# Altium schematic sheet Sheet1.SchDoc
size A4
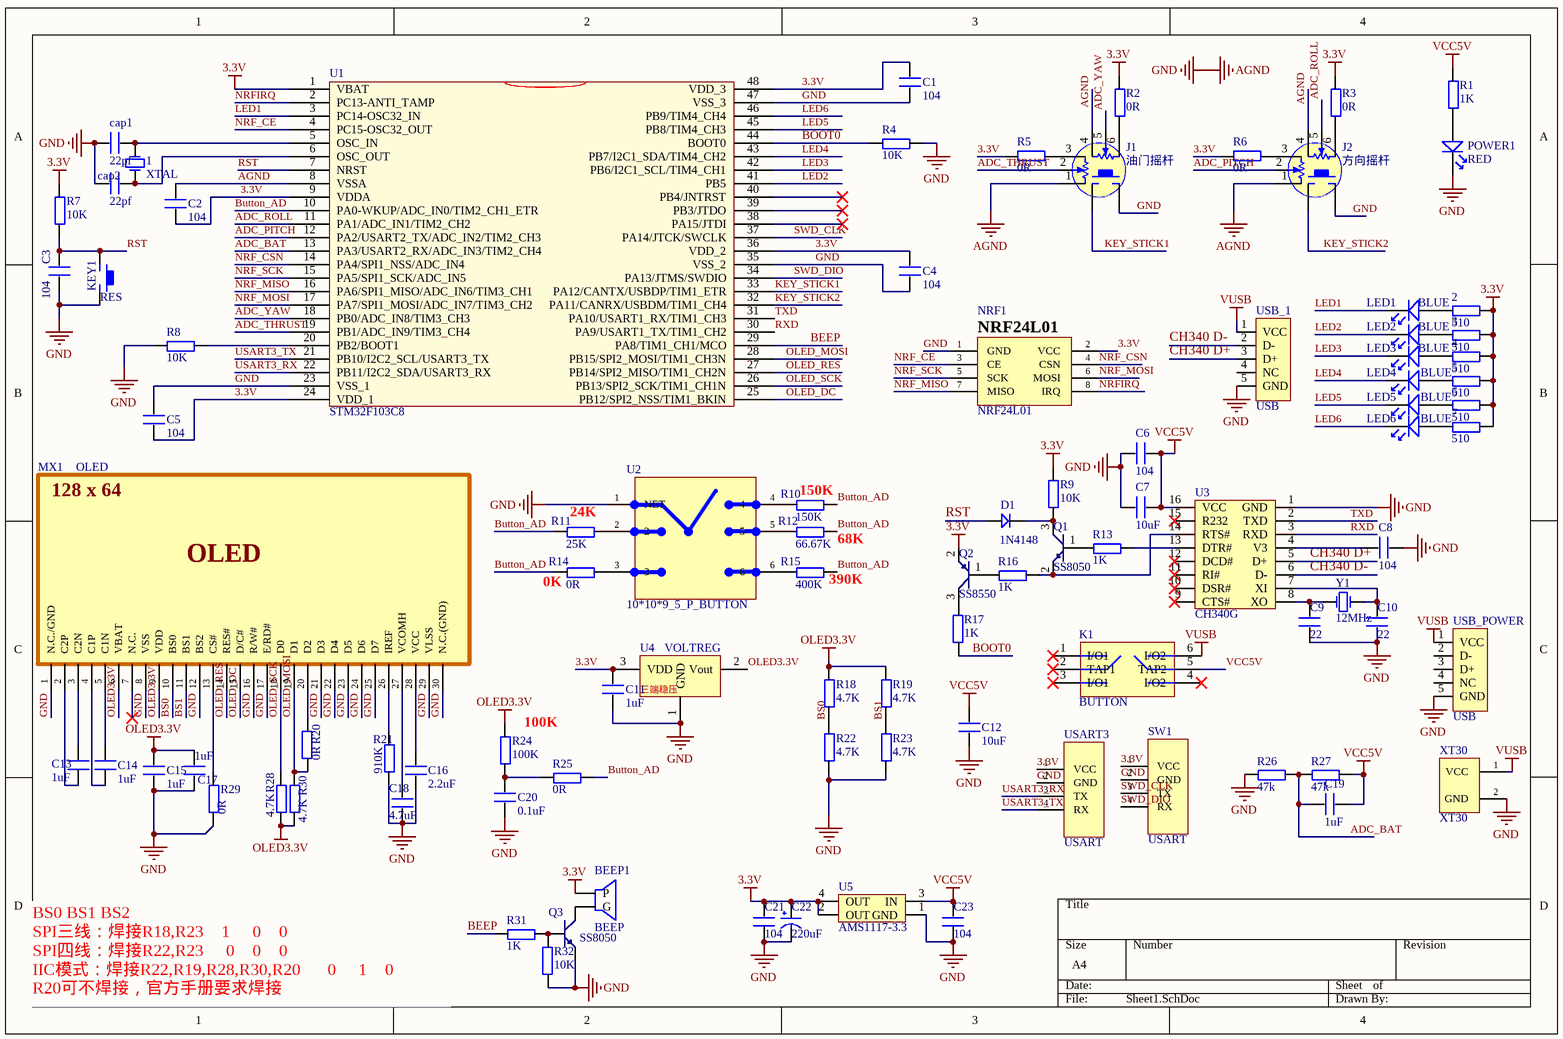
[diagram p0: Sheet1.SchDoc]

## Parts
1  XTAL  [crystal_Dip]
2  510  [0603P]
3  510  [0603P]
4  510  [0603P]
5  510  [0603P]
6  510  [0603P]
7  510  [0603P]
BEEP1  BEEP  [BUZZ0.25]
C1  104  [0603P]
C2  104  [0603P]
C3  104  [0603P]
C4  104  [0603P]
C5  104  [0603P]
C6  104  [0603P]
C7  10uF  [0603P]
C8  104  [0603P]
C9  22  [0603P]
C10  22  [0603P]
C11  1uF  [0603P]
C12  10uF  [0603P]
C13  1uF  [0603P]
C14  1uF  [0603P]
C15  1uF  [0603P]
C16  2.2uF  [0603P]
C17  1uF  [0603P]
C18  4.7uF  [0603P]
C19  1uF  [0603P]
C20  0.1uF  [0603P]
C21  104  [0603P]
C22  220uF  [C0805 钽电容]
C23  104  [0603P]
cap1  22pf  [0603P]
cap2  22pf  [0603P]
D1  1N4148  [DIODE_SOP]
J1  油门摇杆  [摇杆2]
J2  方向摇杆  [摇杆2]
K1  BUTTON  [BTN8*8]
KEY1  RES  [KEY_M]
LED1  BLUE  [0805 LED]
LED2  BLUE  [0805 LED]
LED3  BLUE  [0805 LED]
LED4  BLUE  [0805 LED]
LED5  BLUE  [0805 LED]
LED6  BLUE  [0805 LED]
MX1  OLED  [OLED]
NRF1  NRF24L01  [NRF24L01]
POWER1  RED  [0805 LED]
Q1  SS8050  [SOT-23-3]
Q2  SS8550  [SOT-23-3]
Q3  SS8050  [SOT-23-3]
R1  1K  [0603P]
R2  0R  [0603P]
R3  0R  [0603P]
R4  10K  [0603P]
R5  0R  [0603P]
R6  0R  [0603P]
R7  10K  [0603P]
R8  10K  [0603P]
R9  10K  [0603P]
R10  150K  [0603P]
R11  25K  [0603P]
R12  66.67K  [0603P]
R13  1K  [0603P]
R14  0R  [0603P]
R15  400K  [0603P]
R16  1K  [0603P]
R17  1K  [0603P]
R18  4.7K  [0603P]
R19  4.7K  [0603P]
R20  0R  [0603P]
R21  910K  [0603P]
R22  4.7K  [0603P]
R23  4.7K  [0603P]
R24  100K  [0603P]
R25  0R  [0603P]
R26  47k  [0603P]
R27  47k  [0603P]
R28  4.7K  [0603P]
R29  0R  [0603P]
R30  4.7K  [0603P]
R31  1K  [0603P]
R32  10K  [0603P]
SW1  USART  [GH1.25-立贴-4P]
U1  STM32F103C8  [mTQFP48]
U2  10*10*9_5_P_BUTTON  [10*10*9_5_P_BUTTON]
U3  CH340G  [SOP16M]
U4  VOLTREG  [SOT-23-3]
U5  AMS1117-3.3  [AMS1117]
USART3  USART  [HEAD4]
USB_1  USB  [micro_usb]
USB_POWER  USB  [micro_usb]
XT30  XT30  [POWER_2]
Y1  12MHz  [crystal_Dip]

## Nets
3.3V: 2.2 3.2 4.2 5.2 6.2 7.2 BEEP1.1(P) C1.2 C2.2 C4.2 C5.1 C11.2 C21.1 C22.1(VCC) NRF1.2(VCC) Q2.2(E) R2.2 R3.2 R5.2 R6.2 R7.2 R9.1 SW1.1(VCC) U1.1(VBAT) U1.9(VDDA) U1.24(VDD_1) U1.36(VDD_2) U1.48(VDD_3) U4.3(VDD) U5.2(OUT) U5.4(OUT) USART3.1(VCC)
AGND: C1.1 C2.1 C3.1 C4.1 C5.2 C6.2 C7.2 C8.1 C9.1 C10.1 C11.1 C12.2 C15.1 C16.1 C17.1 C18.1 C20.1 C21.2 C22.2(GND) C23.2 cap1.2 cap2.2 J1.1 J1.4 J1.J1 J2.1 J2.4 J2.J1 KEY1.2 MX1.1(N.C./GND) MX1.8(VSS) MX1.12(BS2) MX1.16(R/W#) MX1.17(E/RD#) MX1.21(D3) MX1.22(D4) MX1.23(D5) MX1.24(D6) MX1.25(D7) MX1.29(VLSS) MX1.30(N.C.(GND)) NRF1.1(GND) POWER1.2 Q3.2(E) R4.2 R8.1 R21.1 R22.1 R23.1 R26.1 R29.1 R32.2 SW1.2(GND) U1.8(VSSA) U1.23(VSS_1) U1.35(VSS_2) U1.47(VSS_3) U2.1(NET) U3.1(GND) U4.1(GND) U5.1(GND) USART3.2(GND) USB_1.5(GND) USB_POWER.5(GND) XT30.2(GND)  [also labelled GND]
OLED3.3V: C15.2 C17.2 MX1.6(VBAT) MX1.9(VDD) R18.2 R19.2 R24.2 R28.1 R30.1 U4.2(Vout)
VCC5V: C6.1 C7.1 C12.1 C19.2 C23.1 K1.5(TAP2) R1.2 R27.2 U3.16(VCC) U5.3(IN)
VUSB: K1.6(I/O2) USB_1.1(VCC) USB_POWER.1(VCC) XT30.1(VCC)
ADC_BAT: C19.1 R26.2 R27.1 U1.13(PA3/USART2_RX/ADC_IN3/TIM2_CH4)
ADC_PITCH: J2.2 U1.12(PA2/USART2_TX/ADC_IN2/TIM2_CH3)
ADC_ROLL: J2.5 U1.11(PA1/ADC_IN1/TIM2_CH2)
ADC_THRUST: J1.2 U1.19(PB1/ADC_IN9/TIM3_CH4)
ADC_YAW: J1.5 U1.18(PB0/ADC_IN8/TIM3_CH3)
BEEP: R31.1 U1.29(PA8/TIM1_CH1/MCO)
BOOT0: R4.1 R17.2 U1.44(BOOT0)
BS0: MX1.10(BS0) R18.1 R22.2
BS1: MX1.11(BS1) R19.1 R23.2
Button_AD: R10.2 R11.1 R12.2 R14.1 R15.2 R25.2 U1.10(PA0-WKUP/ADC_IN0/TIM2_CH1_ETR)
CH340 D+: U3.5(D+) USB_1.3(D+)
CH340 D-: U3.6(D-) USB_1.2(D-)
KEY_STICK1: J1.J2 U1.33(PA12/CANTX/USBDP/TIM1_ETR)
KEY_STICK2: J2.J2 U1.32(PA11/CANRX/USBDM/TIM1_CH4)
LED1: LED1.2 U1.3(PC14-OSC32_IN)
LED2: LED2.2 U1.41(PB5)
LED3: LED3.2 U1.42(PB6/I2C1_SCL/TIM4_CH1)
LED4: LED4.2 U1.43(PB7/I2C1_SDA/TIM4_CH2)
LED5: LED5.2 U1.45(PB8/TIM4_CH3)
LED6: LED6.2 U1.46(PB9/TIM4_CH4)
NRF_CE: NRF1.3(CE) U1.4(PC15-OSC32_OUT)
NRF_CSN: NRF1.4(CSN) U1.14(PA4/SPI1_NSS/ADC_IN4)
NRF_MISO: NRF1.7(MISO) U1.16(PA6/SPI1_MISO/ADC_IN6/TIM3_CH1)
NRF_MOSI: NRF1.6(MOSI) U1.17(PA7/SPI1_MOSI/ADC_IN7/TIM3_CH2)
NRF_SCK: NRF1.5(SCK) U1.15(PA5/SPI1_SCK/ADC_IN5)
NRFIRQ: NRF1.8(IRQ) U1.2(PC13-ANTI_TAMP)
OLED_DC: MX1.15(D/C#) U1.25(PB12/SPI2_NSS/TIM1_BKIN)
OLED_MOSI: MX1.19(D1) R20.2 R30.2 U1.28(PB15/SPI2_MOSI/TIM1_CH3N)
OLED_RES: MX1.14(RES#) U1.27(PB14/SPI2_MISO/TIM1_CH2N)
OLED_SCK: MX1.18(D0) R28.2 U1.26(PB13/SPI2_SCK/TIM1_CH1N)
RST: C3.2 D1.1 KEY1.1 R7.1 U1.7(NRST)
RXD: U1.30(PA9/USART1_TX/TIM1_CH2) U3.3(RXD)
SWD_CLK: SW1.3(TX) U1.37(PA14/JTCK/SWCLK)
SWD_DIO: SW1.4(RX) U1.34(PA13/JTMS/SWDIO)
TXD: U1.31(PA10/USART1_RX/TIM1_CH3) U3.2(TXD)
USART3_RX: U1.22(PB11/I2C2_SDA/USART3_RX) USART3.3(TX)
USART3_TX: U1.21(PB10/I2C2_SCL/USART3_TX) USART3.4(RX)
Net1_1: 1.1(OSC1) cap2.1 U1.6(OSC_OUT)
Net1_2: 1.2(OSC2) cap1.1 U1.5(OSC_IN)
Net2_1: 2.1 LED1.1
Net3_1: 3.1 LED2.1
Net4_1: 4.1 LED3.1
Net5_1: 5.1 LED4.1
Net6_1: 6.1 LED5.1
Net7_1: 7.1 LED6.1
NetBEEP1_2: BEEP1.2(G) Q3.3(C)
NetC8_2: C8.2 U3.4(V3)
NetC9_2: C9.2 U3.8(XO) Y1.2(OSC2)
NetC10_2: C10.2 U3.7(XI) Y1.1(OSC1)
NetC13_1: C13.1 MX1.2(C2P)
NetC13_2: C13.2 MX1.3(C2N)
NetC14_1: C14.1 MX1.4(C1P)
NetC14_2: C14.2 MX1.5(C1N)
NetC16_2: C16.2 MX1.28(VCC)
NetC18_2: C18.2 MX1.27(VCOMH)
NetC20_2: C20.2 R24.1 R25.1
NetD1_2: D1.2 Q1.3(C) R9.2
NetJ1_3: J1.3 R5.1
NetJ1_6: J1.6 R2.1
NetJ2_3: J2.3 R6.1
NetJ2_6: J2.6 R3.1
NetMX1_13: MX1.13(CS#) R29.2
NetMX1_20: MX1.20(D2) R20.1
NetMX1_26: MX1.26(IREF) R21.2
NetPOWER1_1: POWER1.1 R1.1
NetQ1_1: Q1.1(B) R13.2
NetQ1_2: Q1.2(E) R16.1 U3.14(RTS#)
NetQ2_1: Q2.1(B) R16.2
NetQ2_3: Q2.3(C) R17.1
NetQ3_1: Q3.1(B) R31.2 R32.1
NetR8_2: R8.2 U1.20(PB2/BOOT1)
NetR10_1: R10.1 U2.4
NetR11_2: R11.2 U2.2
NetR12_1: R12.1 U2.5
NetR13_1: R13.1 U3.13(DTR#)
NetR14_2: R14.2 U2.3
NetR15_1: R15.1 U2.6

Not connected (* = marked no-connect by the designer): K1 1(I/O1)* 2(TAP1)* 3(I/O1)* 4(I/O2)*; MX1 7(N.C.)*; U1 38(PA15/JTDI)* 39(PB3/JTDO)* 40(PB4/JNTRST)*; U3 9(CTS#)* 10(DSR#)* 11(RI#)* 12(DCD#)* 15(R232)*; USB_1 4(NC); USB_POWER 2(D-) 3(D+) 4(NC)

## Notes on the sheet
- (near R11) 24K
- (near R10) 150K
- (near R14) 0K
- (near R15) 390K
- (near R12) 68K
- (near R24) 100K
- BS0 BS1 BS2
  SPI三线：焊接R18,R23		  1     0    0
  SPI四线：焊接R22,R23		   0    0    0
  IIC模式：焊接R22,R19,R28,R30,R20  	   0     1    0
  R20可不焊接，官方手册要求焊接
- (in symbol OLED) 128 x 64

## Library data of the parts
2-7 R1-R32 = R
C1-C21 C23 cap1 cap2 = C
C22 = CAP
D1 = D
J1 = 摇杆
J2 = 摇杆_1: 摇杆
K1 = BUTTON: 自锁按键
KEY1 = KEY
LED1-LED6 POWER1 = LED
U1 = STM32F103C6
U3 = CH340G: USB2UART
U4 = VOLTREG: 三端稳压
U5 = AMS1117
USB_1 USB_POWER = USB5
Y1 = XTAL_2: Crystal Oscillator; Published: 8-Jun-2000; LatestRevisionDate: 17-Jul-2002; LatestRevisionNote: Re-released for DXP Platform.; Publisher: Altium Limited